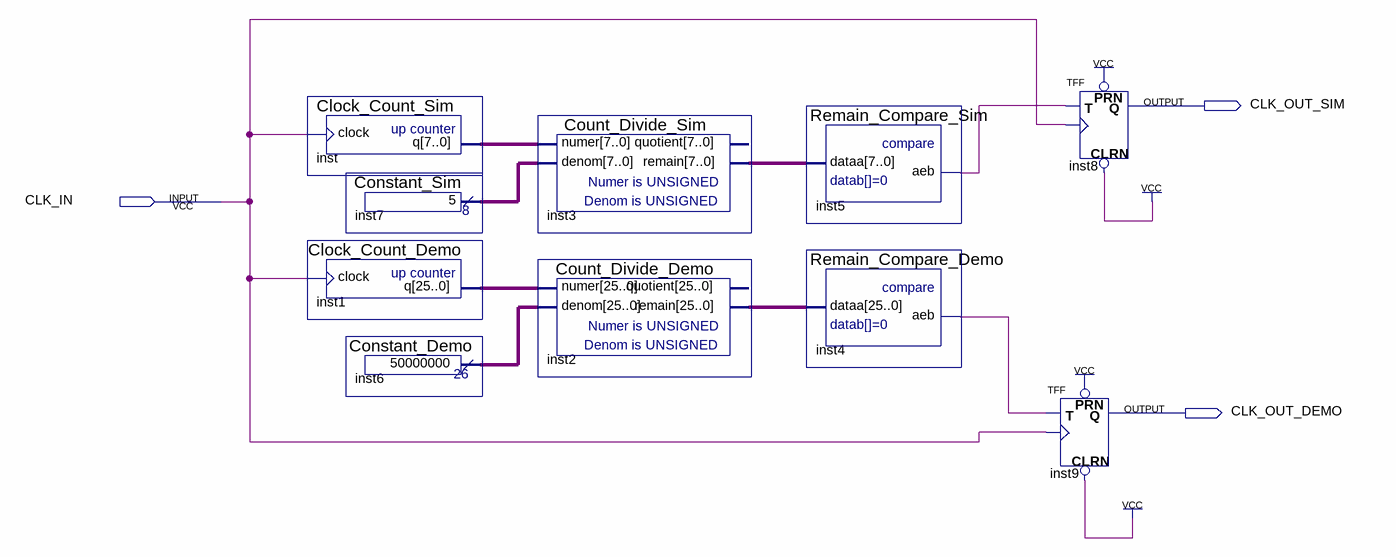
[diagram p0: schematic sheet]
// Quartus schematic clockControl.bdf as structural Verilog: 10 symbols, 3 pins
module clockControl (
  input  CLK_IN,
  output CLK_OUT_SIM,
  output CLK_OUT_DEMO
);

  wire inst4_aeb, inst5_aeb;
  wire [7:0] inst3_remain, inst7_result, inst_q;
  wire [25:0] inst1_q, inst2_remain, inst6_result;

  Clock_Count_Sim inst (.clock(CLK_IN), .q(inst_q));
  Clock_Count_Demo inst1 (.clock(CLK_IN), .q(inst1_q));
  Constant_Sim inst7 (.result(inst7_result));
  Constant_Demo inst6 (.result(inst6_result));
  Count_Divide_Sim inst3 (.numer(inst_q), .denom(inst7_result), .remain(inst3_remain));  // open: quotient
  Count_Divide_Demo inst2 (.numer(inst1_q), .denom(inst6_result), .remain(inst2_remain));  // open: quotient
  Remain_Compare_Sim inst5 (.dataa(inst3_remain), .aeb(inst5_aeb));
  Remain_Compare_Demo inst4 (.dataa(inst2_remain), .aeb(inst4_aeb));
  TFF inst8 (.PRN(1'b1), .CLRN(1'b1), .T(inst5_aeb), .CLK(CLK_IN), .Q(CLK_OUT_SIM));
  TFF inst9 (.PRN(1'b1), .CLRN(1'b1), .T(inst4_aeb), .CLK(CLK_IN), .Q(CLK_OUT_DEMO));
endmodule
